# Altium schematic sheet SI5324_CDR_WR_oscillators.SchDoc: Sayma AMC
size 420 x 297 mm; $$Internal___BlkDate: 0:12:25_2-9-18; $$Internal_NAME_PLACEHOLDER: a3sheet; $$Internal_Resolution: 00001mm; $$NotCommonProperty_@NAME: SI5324_CLK_RECOVERY; $$NotCommonProperty_@PRINTORDER: 30; $$NotCommonProperty_@SHEET: 1; $$NotCommonProperty_@SHEETTOTAL: 30; CmpIndex: 26; Drawing Author: G.Kasprowicz; Drawing Number: Sayma AMC; Drawing Project: AMC FMC Carrier Board; Drawing Revision: 2.0; SymIndex: 2141; CheckedBy: P.Kulik,T.Przywozki,W.Ruclo; Author: G.Kasprowicz; CompanyName: WUT ISE; DrawnBy: G.Kasprowicz; Organization: WUT ISE; Address1: PW ISE; Address2: Nowowiejska 15/19 00-665 Warsaw; Address3: gkasprow@gmail.com; DocumentNumber: 17; Revision: 2; SheetNumber: 17; SheetTotal: 32; ModifiedBy: -; CheckedDate: -; Title2: Si5324 CDR & WR clocks; DivGrp: WUT ISE; Designer: G.Kasprowicz; ModifiedDate: -; ProjectName: Sensor Box
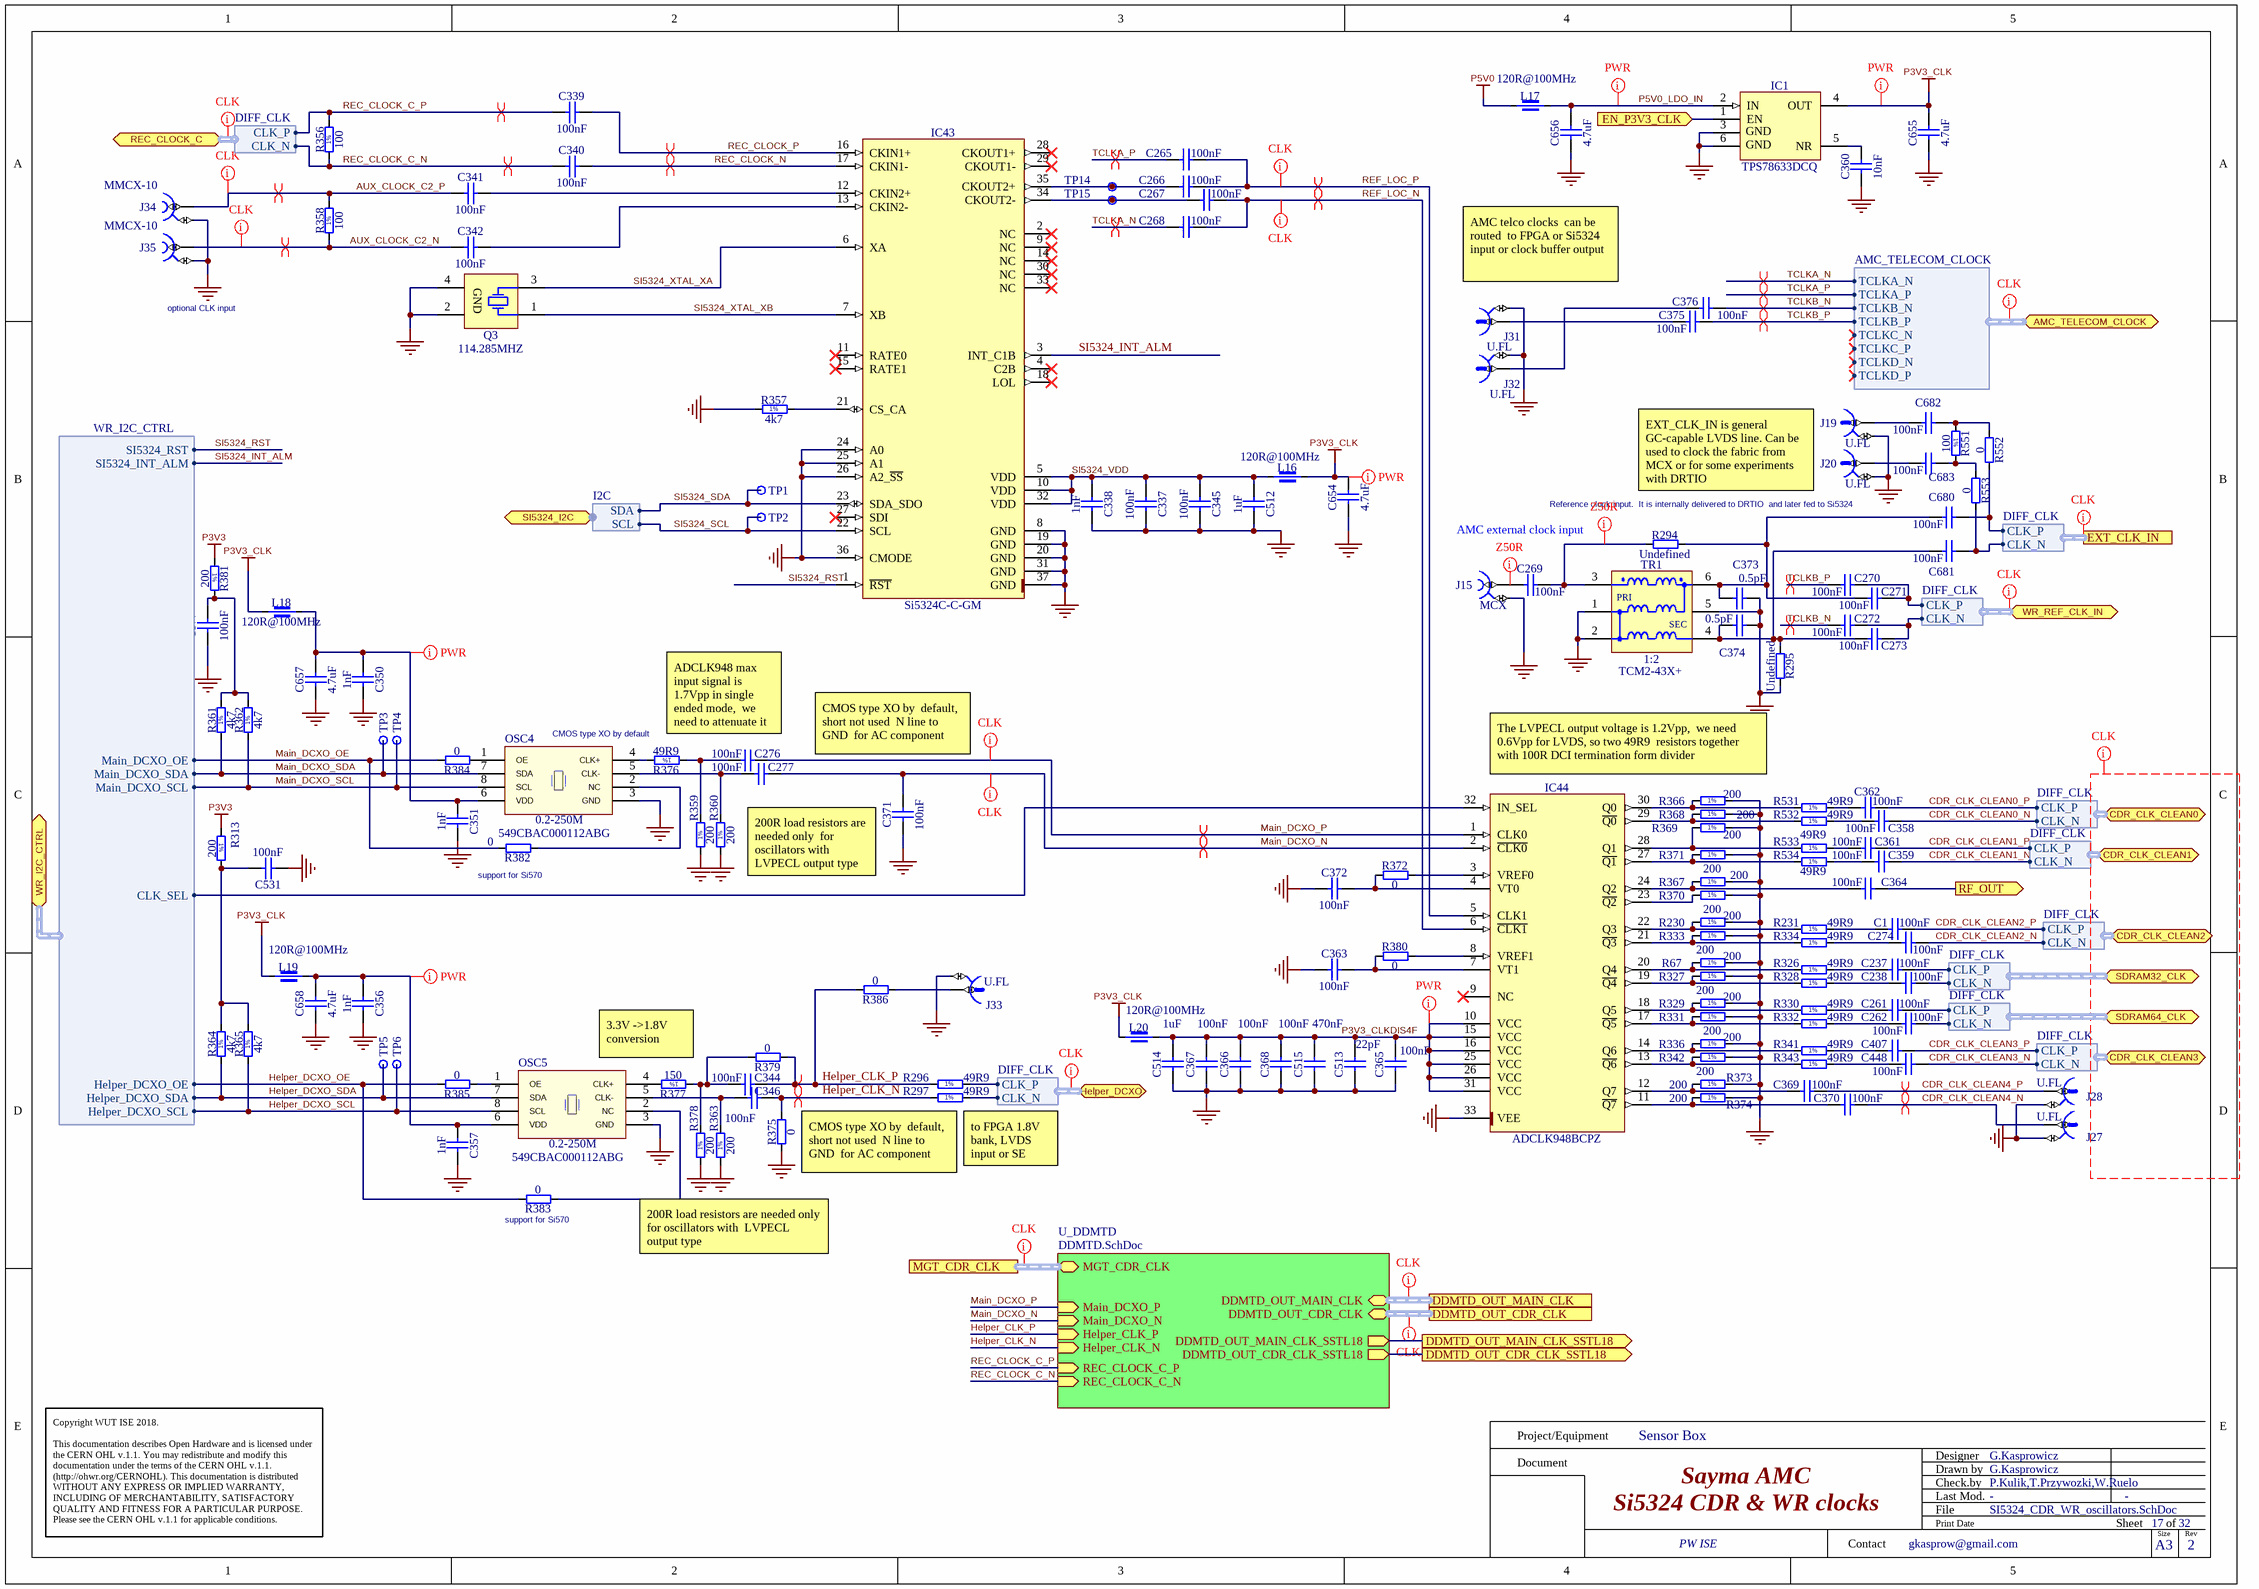
[diagram p0: SI5324_CDR_WR_oscillators.SchDoc]

## Parts
C1  100nF  [CAPC0603X33N]
C237  100nF  [CAPC0603X33N]
C238  100nF  [CAPC0603X33N]
C261  100nF  [CAPC0603X33N]
C262  100nF  [CAPC0603X33N]
C265  100nF  [CAPC1005X55N]
C266  100nF  [CAPC1005X55N]
C267  100nF  [CAPC1005X55N]
C268  100nF  [CAPC1005X55N]
C269  100nF  [CAPC1005X55N]
C270  100nF  [CAPC1005X55N]
C271  100nF  [CAPC1005X55N]
C272  100nF  [CAPC1005X55N]
C273  100nF  [CAPC1005X55N]
C274  100nF  [CAPC0603X33N]
C276  100nF  [CAPC1005X55N]
C277  100nF  [CAPC1005X55N]
C337  100nF  [CAPC0603X33N]
C338  1nF  [CAPC0603X33N]
C339  100nF  [CAPC0603X33N]
C340  100nF  [CAPC0603X33N]
C341  100nF  [CAPC0603X33N]
C342  100nF  [CAPC0603X33N]
C344  100nF  [CAPC1005X55N]
C345  100nF  [CAPC0603X33N]
C346  100nF  [CAPC1005X55N]
C350  1nF  [CAPC0603X33N]
C351  1nF  [CAPC0603X33N]
C356  1nF  [CAPC0603X33N]
C357  1nF  [CAPC0603X33N]
C358  100nF  [CAPC0603X33N]
C359  100nF  [CAPC0603X33N]
C360  10nF  [CAPC1608X87N]
C361  100nF  [CAPC0603X33N]
C362  100nF  [CAPC0603X33N]
C363  100nF  [CAPC0603X33N]
C364  100nF  [CAPC0603X33N]
C365  100nF  [CAPC0603X33N]
C366  100nF  [CAPC0603X33N]
C367  100nF  [CAPC0603X33N]
C368  100nF  [CAPC0603X33N]
C369  100nF  [CAPC0603X33N]
C370  100nF  [CAPC0603X33N]
C371  100nF  [CAPC0603X33N]
C372  100nF  [CAPC0603X33N]
C373  0.5pF  [CAPC1005X50N]
C374  0.5pF  [CAPC1005X50N]
C375  100nF  [CAPC0603X33N]
C376  100nF  [CAPC0603X33N]
C377  100nF  [CAPC0603X33N]
C407  100nF  [CAPC0603X33N]
C448  100nF  [CAPC0603X33N]
C512  1uF  [CAPC1005X55N]
C513  22pF  [CAPC1005X55N]
C514  1uF  [CAPC1005X55N]
C515  470nF  [CAPC1005X55N]
C531  100nF  [CAPC0603X33N]
C654  4.7uF  [CAPC1608X90N]
C655  4.7uF  [CAPC1608X90N]
C656  4.7uF  [CAPC1608X90N]
C657  4.7uF  [CAPC1608X90N]
C658  4.7uF  [CAPC1608X90N]
C680  100nF  [CAPC1005X55N]
C681  100nF  [CAPC1005X55N]
C682  100nF  [CAPC1005X55N]
C683  100nF  [CAPC1005X55N]
IC1  TPS78633DCQ  [SOT127P700X180-6N]
IC43  Si5324C-C-GM  [QFN50P600X600X90-37N-S425]
IC44  ADCLK948BCPZ  [QFN50P500X500X80-33N-S285]
J15  MCX  [AMPHENOL_ARF2521-ND]
J19  U.FL  [HIROSE_U.FL-R-SMT-1(10)]
J20  U.FL  [HIROSE_U.FL-R-SMT-1(10)]
J27  U.FL  [HIROSE_U.FL-R-SMT-1(10)]
J28  U.FL  [HIROSE_U.FL-R-SMT-1(10)]
J31  U.FL  [HIROSE_U.FL-R-SMT-1(10)]
J32  U.FL  [HIROSE_U.FL-R-SMT-1(10)]
J33  U.FL  [HIROSE_U.FL-R-SMT-1(10)]
J34  Part Number: MMCX-10  [NINIGI_MMCX-10]  (hidden comment: Coax_1Female_1Shield)
J35  Part Number: MMCX-10  [NINIGI_MMCX-10]  (hidden comment: Coax_1Female_1Shield)
L16  120R@100MHz  [INDC1608X95N]
L17  120R@100MHz  [INDC1608X95N]
L18  120R@100MHz  [INDC1608X95N]
L19  120R@100MHz  [INDC1608X95N]
L20  120R@100MHz  [INDC1608X95N]
OSC4  0.2-250M  Manufacturer Part Number: 549CBAC000112ABG  [OSC_SILICON-LAB_SI549]
OSC5  0.2-250M  Manufacturer Part Number: 549CBAC000112ABG  [OSC_SILICON-LAB_SI549]
Q3  114.285MHZ  [XTAL_CONNOR_CS]
R67  200  [RESC1005X40N]
R230  200  [RESC1005X40N]
R231  49R9  [RESC1005X40N]
R294  Undefined  [RESC1005X40N]
R295  Undefined  [RESC1005X40N]
R296  49R9  [RESC1005X40N]
R297  49R9  [RESC1005X40N]
R313  200  [RESC1005X40N]
R326  49R9  [RESC1005X40N]
R327  200  [RESC1005X40N]
R328  49R9  [RESC1005X40N]
R329  200  [RESC1005X40N]
R330  49R9  [RESC1005X40N]
R331  200  [RESC1005X40N]
R332  49R9  [RESC1005X40N]
R333  200  [RESC1005X40N]
R334  49R9  [RESC1005X40N]
R336  200  [RESC1005X40N]
R341  49R9  [RESC1005X40N]
R342  200  [RESC1005X40N]
R343  49R9  [RESC1005X40N]
R356  100  [RESC1005X40N]
R357  4k7  [RESC1005X40N]
R358  100  [RESC1005X40N]
R359  200  [RESC1005X40N]
R360  200  [RESC1005X40N]
R361  4k7  [RESC1005X40N]
R362  4k7  [RESC1005X40N]
R363  200  [RESC1005X40N]
R364  4k7  [RESC1005X40N]
R365  4k7  [RESC1005X40N]
R366  200  [RESC1005X40N]
R367  200  [RESC1005X40N]
R368  200  [RESC1005X40N]
R369  200  [RESC1005X40N]
R370  200  [RESC1005X40N]
R371  200  [RESC1005X40N]
R372  0  [RESC1005X40N]
R373  200  [RESC1005X40N]
R374  200  [RESC1005X40N]
R375  0  [RESC1005X40N]
R376  49R9  [RESC1005X40N]
R377  150  [RESC1005X40N]
R378  200  [RESC1005X40N]
R379  0  [RESC1005X40N]
R380  0  [RESC1005X40N]
R381  200  [RESC1005X40N]
R382  0  [RESC1005X40N]
R383  0  [RESC1005X40N]
R384  0  [RESC1005X40N]
R385  0  [RESC1005X40N]
R386  0  [RESC1005X40N]
R531  49R9  [RESC1005X40N]
R532  49R9  [RESC1005X40N]
R533  49R9  [RESC1005X40N]
R534  49R9  [RESC1005X40N]
R551  100  [RESC1005X40N]
R552  0  [RESC1005X40N]
R553  0  [RESC1005X40N]
TP1  Test Point  [TPS127]  (value not drawn)
TP2  Test Point  [TPS127]  (value not drawn)
TP3  Test Point  [TPS127]  (value not drawn)
TP4  Test Point  [TPS127]  (value not drawn)
TP5  Test Point  [TPS127]  (value not drawn)
TP6  Test Point  [TPS127]  (value not drawn)
TP14  Test Point  [TPS127]  (value not drawn)
TP15  Test Point  [TPS127]  (value not drawn)
TR1  1:2  Manufacturer Part Number: TCM2-43X+  [XFMR_MINI-CIRCUITS_DB1627]

## Sub-sheets
U_DDMTD = DDMTD.SchDoc: MGT_CDR_CLK (bidir, harness DIFF_CLK), DDMTD_OUT_CDR_CLK (bidir, harness DIFF_CLK), DDMTD_OUT_MAIN_CLK (bidir, harness DIFF_CLK), Main_DCXO_P (in), Main_DCXO_N (in), Helper_CLK_P (in), Helper_CLK_N (in), REC_CLOCK_C_P (in), REC_CLOCK_C_N (in), DDMTD_OUT_MAIN_CLK_SSTL18 (out), DDMTD_OUT_CDR_CLK_SSTL18 (out)

## Ports
AMC_TELECOM_CLOCK (bidir, harness AMC_TELECOM_CLOCK), CDR_CLK_CLEAN0 (bidir, harness DIFF_CLK), CDR_CLK_CLEAN1 (bidir, harness DIFF_CLK), CDR_CLK_CLEAN2 (bidir, harness DIFF_CLK), CDR_CLK_CLEAN3 (bidir, harness DIFF_CLK), DDMTD_OUT_CDR_CLK (harness DIFF_CLK), DDMTD_OUT_CDR_CLK_SSTL18 (out), DDMTD_OUT_MAIN_CLK (harness DIFF_CLK), DDMTD_OUT_MAIN_CLK_SSTL18 (out), EN_P3V3_CLK (in), EXT_CLK_IN (harness DIFF_CLK), Helper_DCXO (bidir, harness DIFF_CLK), MGT_CDR_CLK (harness DIFF_CLK), REC_CLOCK_C (bidir, harness DIFF_CLK), RF_OUT (out), SDRAM32_CLK (bidir, harness DIFF_CLK), SDRAM64_CLK (bidir, harness DIFF_CLK), SI5324_I2C (bidir, harness I2C), WR_I2C_CTRL (bidir, harness WR_I2C_CTRL), WR_REF_CLK_IN (bidir, harness DIFF_CLK)

## Harnesses
AMC_TELECOM_CLOCK: TCLKA_N, TCLKA_P, TCLKB_N, TCLKB_P, TCLKC_N, TCLKC_P, TCLKD_N, TCLKD_P
I2C: SCL, SDA
WR_I2C_CTRL: Main_DCXO_OE, Main_DCXO_SDA, Main_DCXO_SCL, Helper_DCXO_OE, Helper_DCXO_SDA, Helper_DCXO_SCL, CLK_SEL, SI5324_RST, SI5324_INT_ALM
DIFF_CLK: CLK_N, CLK_P

## Nets
GND: C337.1 C338.1 C345.1 C350.1 C351.1 C356.1 C357.1 C360.1 C363.1 C365.1 C366.1 C367.1 C368.1 C371.1 C372.1 C373.2 C374.2 C377.1 C512.2 C513.1 C514.2 C515.1 C531.1 C654.1 C655.1 C656.1 C657.1 C658.1 IC1.3(GND) IC1.6(GND) IC43.8(GND) IC43.19(GND) IC43.20(GND) IC43.24(A0) IC43.25(A1) IC43.26(A2_~{SS}) IC43.31(GND) IC43.36(CMODE) IC43.37(GND) IC44.33(VEE) J15.2 J19.2 J20.2 J27.2 J28.2 J31.2 J32.2 J33.2 J34.2 J35.2 OSC4.3(GND) OSC5.3(GND) Q3.2(GND) Q3.4(GND) R67.2 R230.2 R295.1 R327.2 R329.2 R331.2 R333.2 R336.2 R342.2 R357.1 R359.1 R360.1 R363.1 R366.2 R367.2 R368.2 R369.2 R370.2 R371.2 R373.2 R374.2 R375.1 R378.1 TR1.1(P1) TR1.2(P1) TR1.5(NC)
P3V3: R313.1 R381.1
P3V3_CLK: C654.2 C655.2 IC1.4(OUT) L16.1 L18.1 L19.1 L20.1
P5V0: L17.1
AUX_CLOCK_C2_N: C342.2 J35.1 R358.1
AUX_CLOCK_C2_P: C341.2 J34.1 R358.2
CDR_CLK_CLEAN0_N: C358.2 ; port CDR_CLK_CLEAN0.CLK_N
CDR_CLK_CLEAN0_P: C362.2 ; port CDR_CLK_CLEAN0.CLK_P
CDR_CLK_CLEAN1_N: C359.2 ; port CDR_CLK_CLEAN1.CLK_N
CDR_CLK_CLEAN1_P: C361.2 ; port CDR_CLK_CLEAN1.CLK_P
CDR_CLK_CLEAN2_N: C274.2 ; port CDR_CLK_CLEAN2.CLK_N
CDR_CLK_CLEAN2_P: C1.2 ; port CDR_CLK_CLEAN2.CLK_P
CDR_CLK_CLEAN3_N: C448.2 ; port CDR_CLK_CLEAN3.CLK_N
CDR_CLK_CLEAN3_P: C407.2 ; port CDR_CLK_CLEAN3.CLK_P
CDR_CLK_CLEAN4_N: C370.2 J27.1
CDR_CLK_CLEAN4_P: C369.2 J28.1
DDMTD_OUT_CDR_CLK_SSTL18: port DDMTD_OUT_CDR_CLK_SSTL18, sheet U_DDMTD/DDMTD_OUT_CDR_CLK_SSTL18
DDMTD_OUT_MAIN_CLK_SSTL18: port DDMTD_OUT_MAIN_CLK_SSTL18, sheet U_DDMTD/DDMTD_OUT_MAIN_CLK_SSTL18
EN_P3V3_CLK: IC1.1(EN) ; port EN_P3V3_CLK
Helper_CLK_N: C346.2 R297.1 R375.2 ; sheet U_DDMTD/Helper_CLK_N
Helper_CLK_P: C344.2 R296.1 R379.1 R386.2 ; sheet U_DDMTD/Helper_CLK_P
Helper_DCXO_OE: R383.2 R385.2 ; port WR_I2C_CTRL.Helper_DCXO_OE
Helper_DCXO_SCL: OSC5.8(SCL) R365.1 TP6.1 ; port WR_I2C_CTRL.Helper_DCXO_SCL
Helper_DCXO_SDA: OSC5.7(SDA) R364.1 TP5.1 ; port WR_I2C_CTRL.Helper_DCXO_SDA
Main_DCXO_N: C277.2 C371.2 IC44.2(~{CLK0}) ; sheet U_DDMTD/Main_DCXO_N
Main_DCXO_OE: R382.2 R384.2 ; port WR_I2C_CTRL.Main_DCXO_OE
Main_DCXO_P: C276.2 IC44.1(CLK0) ; sheet U_DDMTD/Main_DCXO_P
Main_DCXO_SCL: OSC4.8(SCL) R362.1 TP4.1 ; port WR_I2C_CTRL.Main_DCXO_SCL
Main_DCXO_SDA: OSC4.7(SDA) R361.1 TP3.1 ; port WR_I2C_CTRL.Main_DCXO_SDA
P3V3_CLKDIS4F: C365.2 C366.2 C367.2 C368.2 C513.2 C514.1 C515.2 IC44.10(VCC) IC44.15(VCC) IC44.16(VCC) IC44.25(VCC) IC44.26(VCC) IC44.31(VCC) L20.2
P5V0_LDO_IN: C656.2 IC1.2(IN) L17.2
REC_CLOCK_C_N: C340.2 R356.1 ; sheet U_DDMTD/REC_CLOCK_C_N, port REC_CLOCK_C.CLK_N
REC_CLOCK_C_P: C339.2 R356.2 ; sheet U_DDMTD/REC_CLOCK_C_P, port REC_CLOCK_C.CLK_P
REC_CLOCK_N: C340.1 IC43.17(CKIN1-)
REC_CLOCK_P: C339.1 IC43.16(CKIN1+)
REF_LOC_N: C267.2 C268.2 IC44.6(~{CLK1})
REF_LOC_P: C265.2 C266.2 IC44.5(CLK1)
RF_OUT: C364.2 ; port RF_OUT
SI5324_INT_ALM: IC43.3(INT_C1B) ; port WR_I2C_CTRL.SI5324_INT_ALM
SI5324_RST: IC43.1(~{RST}) ; port WR_I2C_CTRL.SI5324_RST
SI5324_SCL: IC43.22(SCL) TP2.1 ; port SI5324_I2C.SCL
SI5324_SDA: IC43.23(SDA_SDO) TP1.1 ; port SI5324_I2C.SDA
SI5324_VDD: C337.2 C338.2 C345.2 C512.1 IC43.5(VDD) IC43.10(VDD) IC43.32(VDD) L16.2
SI5324_XTAL_XA: IC43.6(XA) Q3.3(X)
SI5324_XTAL_XB: IC43.7(XB) Q3.1(X)
TCLKA_N: C268.1 ; port AMC_TELECOM_CLOCK.TCLKA_N
TCLKA_P: C265.1 ; port AMC_TELECOM_CLOCK.TCLKA_P
TCLKB_N: C272.1 C376.2 ; port AMC_TELECOM_CLOCK.TCLKB_N
TCLKB_P: C270.1 C375.2 ; port AMC_TELECOM_CLOCK.TCLKB_P
NetC1_1: C1.1 R231.2
NetC237_1: C237.1 R326.2
NetC237_2: C237.2 ; port SDRAM32_CLK.CLK_P
NetC238_1: C238.1 R328.2
NetC238_2: C238.2 ; port SDRAM32_CLK.CLK_N
NetC261_1: C261.1 R330.2
NetC261_2: C261.2 ; port SDRAM64_CLK.CLK_P
NetC262_1: C262.1 R332.2
NetC262_2: C262.2 ; port SDRAM64_CLK.CLK_N
NetC266_1: C266.1 IC43.35(CKOUT2+) TP14.1
NetC267_1: C267.1 IC43.34(CKOUT2-) TP15.1
NetC269_1: C269.1 J15.1
NetC269_2: C269.2 R294.2 TR1.3(P1)
NetC270_2: C270.2 C271.2 ; port WR_REF_CLK_IN.CLK_P
NetC271_1: C271.1 C373.1 C680.1 R294.1 TR1.6(S1)
NetC272_2: C272.2 C273.2 ; port WR_REF_CLK_IN.CLK_N
NetC273_1: C273.1 C374.1 C681.1 R295.2 TR1.4(S1)
NetC274_1: C274.1 R334.2
NetC276_1: C276.1 R359.2 R376.1
NetC277_1: C277.1 OSC4.5(CLK-) R360.2
NetC341_1: C341.1 IC43.12(CKIN2+)
NetC342_1: C342.1 IC43.13(CKIN2-)
NetC344_1: C344.1 R377.1 R378.2 R379.2
NetC346_1: C346.1 OSC5.5(CLK-) R363.2
NetC350_2: C350.2 C351.2 C657.2 L18.2 OSC4.6(VDD)
NetC356_2: C356.2 C357.2 C658.2 L19.2 OSC5.6(VDD)
NetC358_1: C358.1 R532.2
NetC359_1: C359.1 R534.2
NetC360_2: C360.2 IC1.5(NR)
NetC361_1: C361.1 R533.2
NetC362_1: C362.1 R531.2
NetC363_2: C363.2 IC44.7(VT1) R380.1
NetC364_1: C364.1 IC44.24(Q2) R367.1
NetC369_1: C369.1 IC44.12(Q7) R373.1
NetC370_1: C370.1 IC44.11(~{Q7}) R374.1
NetC372_2: C372.2 IC44.4(VT0) R372.1
NetC375_1: C375.1 J31.1
NetC376_1: C376.1 J32.1
NetC377_2: C377.2 R361.2 R362.2 R381.2
NetC407_1: C407.1 R341.2
NetC448_1: C448.1 R343.2
NetC531_2: C531.2 R313.2 R364.2 R365.2
NetC680_2: C680.2 R552.2 ; port EXT_CLK_IN.CLK_P
NetC681_2: C681.2 R553.2 ; port EXT_CLK_IN.CLK_N
NetC682_1: C682.1 J19.1
NetC682_2: C682.2 R551.1 R552.1
NetC683_1: C683.1 J20.1
NetC683_2: C683.2 R551.2 R553.1
NetIC43_21: IC43.21(CS_CA) R357.2
NetIC44_3: IC44.3(VREF0) R372.2
NetIC44_8: IC44.8(VREF1) R380.2
NetIC44_13: IC44.13(~{Q6}) R342.1 R343.1
NetIC44_14: IC44.14(Q6) R336.1 R341.1
NetIC44_17: IC44.17(~{Q5}) R331.1 R332.1
NetIC44_18: IC44.18(Q5) R329.1 R330.1
NetIC44_19: IC44.19(~{Q4}) R327.1 R328.1
NetIC44_20: IC44.20(Q4) R67.1 R326.1
NetIC44_21: IC44.21(~{Q3}) R333.1 R334.1
NetIC44_22: IC44.22(Q3) R230.1 R231.1
NetIC44_23: IC44.23(~{Q2}) R370.1
NetIC44_27: IC44.27(~{Q1}) R371.1 R534.1
NetIC44_28: IC44.28(Q1) R369.1 R533.1
NetIC44_29: IC44.29(~{Q0}) R368.1 R532.1
NetIC44_30: IC44.30(Q0) R366.1 R531.1
NetIC44_32: IC44.32(IN_SEL) ; port WR_I2C_CTRL.CLK_SEL
NetJ33_1: J33.1 R386.1
NetOSC4_1: OSC4.1(OE) R384.1
NetOSC4_2: OSC4.2(NC) R382.1
NetOSC4_4: OSC4.4(CLK+) R376.2
NetOSC5_1: OSC5.1(OE) R385.1
NetOSC5_2: OSC5.2(NC) R383.1
NetOSC5_4: OSC5.4(CLK+) R377.2
NetR296_2: R296.2 ; port Helper_DCXO.CLK_P
NetR297_2: R297.2 ; port Helper_DCXO.CLK_N

Not connected (* = marked no-connect by the designer): IC43 2(NC)* 4(C2B)* 9(NC)* 11(RATE0)* 14(NC)* 15(RATE1)* 18(LOL)* 27(SDI)* 28(CKOUT1+)* 29(CKOUT1-)* 30(NC)* 33(NC)*; IC44 9(NC)*

## Buses and harness runs
harness port DDMTD_OUT_CDR_CLK = sheet U_DDMTD/DDMTD_OUT_CDR_CLK
harness port DDMTD_OUT_MAIN_CLK = sheet U_DDMTD/DDMTD_OUT_MAIN_CLK
harness port MGT_CDR_CLK = sheet U_DDMTD/MGT_CDR_CLK

## Layout directives
differential pair: AUX_CLOCK_C2_N, AUX_CLOCK_C2_P, CDR_CLK_CLEAN4_N, CDR_CLK_CLEAN4_P, Helper_CLK_N, Helper_CLK_P, Main_DCXO_N, Main_DCXO_P, REC_CLOCK_C_N, REC_CLOCK_C_P, REC_CLOCK_N, REC_CLOCK_P, REF_LOC_N, REF_LOC_P, TCLKA_N, TCLKA_P, TCLKB_N, TCLKB_P
net class PWR: NetC350_2, NetC356_2, P3V3_CLK, P3V3_CLKDIS4F, P5V0_LDO_IN
net class CLK: (no net found under the mark), AUX_CLOCK_C2_N, AUX_CLOCK_C2_P, Main_DCXO_N, Main_DCXO_P, REF_LOC_N, REF_LOC_P
net class Z50R: NetC269_1, NetC269_2

## Notes on the sheet
- (near J35) optional CLK input
- (near J31) AMC telco clocks  can be routed  to FPGA or Si5324  input or clock buffer output
- AMC external clock input
- EXT_CLK_IN is general GC-capable LVDS line. Can be used to clock the fabric from MCX or for some experiments with DRTIO
- Reference clock input.  It is internally delivered to DRTIO  and later fed to Si5324
- ADCLK948 max input signal is 1.7Vpp in single  ended mode,  we need to attenuate it
- CMOS type XO by default
- CMOS type XO by  default, short not used  N line to GND  for AC component
- The LVPECL output voltage is 1.2Vpp,  we need 0.6Vpp for LVDS, so two 49R9  resistors together with 100R DCI termination form divider
- (near R382) support for Si570
- 200R load resistors are needed only  for oscillators with  LVPECL output type
- 3.3V ->1.8V  conversion
- (near R297) to FPGA 1.8V bank, LVDS input or SE mode
- (near R383) support for Si570
- Project/Equipment
- Document
- Designer
- Drawn by
- Check.by
- Copyright WUT ISE 2018.
  This documentation describes Open Hardware and is licensed under the CERN OHL v.1.1. You may redistribute and modify this documentation under the terms of the CERN OHL v.1.1. (http://ohwr.org/CERNOHL). This documentation is distributed WITHOUT ANY EXPRESS OR IMPLIED WARRANTY, INCLUDING OF MERCHANTABILITY, SATISFACTORY QUALITY AND FITNESS FOR A PARTICULAR PURPOSE. Please see the CERN OHL v.1.1 for applicable conditions.
- Contact
- File
- Last Mod.
- Print Date
- Sheet
- Size
- A3
- of
- Rev
- (in symbol R0402_4K7_1%_0.0625W_100PPM) 1%
- (in symbol R0402_49R9_1%_0.0625W_100PPM) 1%
- (in symbol R0402_100R_1%_0.0625W_100PPM) 1%
- (in symbol R0402_150R_1%_0.0625W_100PPM) 1%
- (in symbol R0402_200R_1%_0.0625W_100PPM) 1%
- (in symbol XFMR_MINI-CIRCUITS_TCM2-43X+) PRI; SEC

## Library data of the parts
C1 C237 C238 C261 C262 C274 C337 C339-C342 C345 C358 C359 C361-C372 C375-C377 C407 C448 C531 = CC0201_100NF_6.3V_10%_X5R: Non-polarised capacitor; Manufacturer: GENERIC; Part Description: SMD Multilayer Chip Ceramic Capacitor; Manufacturer1 Part Number: 02016D104KAT2A; Tolerance: ±10%; Voltage: 6.3V; TC: X5R; Manufacturer Part Number: CC0201_100NF_6.3V_10%_X5R; Part Number: CC0201_100NF_6.3V_10%_X5R; Value: 100nF; Component Kind: Standard; Component Type: Standard; Pin Count: 2; Status: Not Recommended; Case: 0201; Mounted: Yes; Socket: No; SMD: Yes; Sense: No; Manufacturer1 Example: AVX; Manufacturer1 ComponentHeight: 0.33mm; HelpURL: \\cern.ch\dfs\Applications\Altium\Datasheets\CC0201_X5R_AVX.pdf; Author: CERN DEM JLC; CreateDate: 03.12.2007; LatestRevisionDate: 03.12.2007
C265-C273 C276 C277 C344 C346 C680-C683 = CC0402_100NF_16V_10%_X5R: Non-polarised capacitor; Manufacturer: GENERIC; Manufacturer1 Part Number: GRM155R61C104KA88D; Part Description: SMD Multilayer Chip Ceramic Capacitor; TC: X5R; Tolerance: ±10%; Voltage: 16V; Case: 0402; Manufacturer Part Number: CC0402_100NF_16V_10%_X5R; Manufacturer1 Example: MURATA; Part Number: CC0402_100NF_16V_10%_X5R; Pin Count: 2; SMD: Yes; Status: None; Value: 100nF; Component Kind: Standard; Component Type: Standard; Mounted: Yes; Socket: No; Sense: No; Manufacturer1 ComponentHeight: 0.55mm; HelpURL: \\cern.ch\dfs\Applications\Altium\Datasheets\CC0402_X5R_MURATA_GRM.pdf; Author: CERN DEM JLC; CreateDate: 10.12.2013; LatestRevisionDate: 10.12.2013
C338 C350 C351 C356 C357 = CC0201_1NF_16V_10%_X5R: Non-polarised capacitor; Manufacturer: GENERIC; Part Description: SMD Multilayer Chip Ceramic Capacitor; Manufacturer1 Part Number: 0201YD102KAT2A; Tolerance: ±10%; Voltage: 16V; TC: X5R; Manufacturer Part Number: CC0201_1NF_16V_10%_X5R; Part Number: CC0201_1NF_16V_10%_X5R; Value: 1nF; Component Kind: Standard; Component Type: Standard; Pin Count: 2; Status: Not Recommended; Case: 0201; Mounted: Yes; Socket: No; SMD: Yes; Sense: No; Manufacturer1 Example: AVX; Manufacturer1 ComponentHeight: 0.33mm; HelpURL: \\cern.ch\dfs\Applications\Altium\Datasheets\CC0201_X5R_AVX.pdf; Author: CERN DEM JLC; CreateDate: 03.12.2007; LatestRevisionDate: 03.12.2007
C360 = CC0603_10NF_50V_5%_C0G: Non-polarised capacitor; Part Description: SMD Multilayer Chip Ceramic Capacitor; Manufacturer: GENERIC; Manufacturer1 Part Number: C1608C0G1H103J080AA; Voltage: 50V; TC: C0G/NP0; Tolerance: ±5%; Part Number: CC0603_10NF_50V_5%_C0G; Component Kind: Standard; Component Type: Standard; Pin Count: 2; Value: 10nF; Status: Preferred; Manufacturer Part Number: CC0603_10NF_50V_5%_C0G; Case: 0603; Mounted: Yes; Socket: No; SMD: Yes; Sense: No; Manufacturer1 Example: TDK; Manufacturer1 ComponentHeight: 0.9mm; HelpURL: \\cern.ch\dfs\Applications\Altium\Datasheets\CC0603_C0G_TDK_C.pdf; Author: CERN DEM JLC; CreateDate: 10.12.2014; LatestRevisionDate: 10.12.2014
C373 C374 = CC0402_0.5PF_25V_0.05PF_AVX_04023J0R5ABSTR: Non-polarised capacitor; Part Description: Thin-Film Chip Capacitors for RF Signal and Power Applications, Accu-P Series; Manufacturer: AVX; Voltage: 25V; Tolerance: ±0.05pF; Part Number: CC0402_0.5PF_25V_0.05PF_AVX_04023J0R5ABSTR; Component Kind: Standard; Component Type: Standard; Pin Count: 2; Value: 0.5pF; Status: None; Manufacturer Part Number: 04023J0R5ABSTR; Case: 0402; Mounted: Yes; Socket: No; SMD: Yes; Sense: No; ComponentHeight: 0.5mm; HelpURL: \\cern.ch\dfs\Applications\Altium\Datasheets\CC0402_AVX_ACCU-P.pdf; Author: CERN DEM JLC; CreateDate: 22.02.2017; LatestRevisionDate: 22.02.2017
C512 C514 = CC0402_1UF_16V_10%_X5R: Non-polarised capacitor; Manufacturer: GENERIC; Part Description: SMD Multilayer Chip Ceramic Capacitor; Manufacturer1 Part Number: C1005X5R1C105KT; Tolerance: ±10%; Voltage: 16V; TC: X5R; Manufacturer Part Number: CC0402_1UF_16V_10%_X5R; Part Number: CC0402_1UF_16V_10%_X5R; Value: 1uF; Component Kind: Standard; Component Type: Standard; Pin Count: 2; Status: Preferred; Case: 0402; Mounted: Yes; Socket: No; SMD: Yes; Sense: No; Manufacturer1 Example: TDK; Manufacturer1 ComponentHeight: 0.55mm; HelpURL: \\cern.ch\dfs\Applications\Altium\Datasheets\CC0402_X5R_TDK_C.pdf; Author: CERN DEM JLC; CreateDate: 25.10.2012; LatestRevisionDate: 25.10.2012
C513 = CC0402_22PF_50V_5%_C0G: Non-polarised capacitor; Manufacturer: GENERIC; Part Description: SMD Multilayer Chip Ceramic Capacitor; Manufacturer1 Part Number: C0402C220J5GACTU; Tolerance: ±5%; Voltage: 50V; TC: C0G/NP0; Manufacturer Part Number: CC0402_22PF_50V_5%_C0G; Part Number: CC0402_22PF_50V_5%_C0G; Value: 22pF; Component Kind: Standard; Component Type: Standard; Pin Count: 2; Status: Preferred; Case: 0402; Mounted: Yes; Socket: No; SMD: Yes; Sense: No; Manufacturer1 Example: KEMET; Manufacturer1 ComponentHeight: 0.55mm; HelpURL: \\cern.ch\dfs\Applications\Altium\Datasheets\CC0805_C0G_KEMET_(Commercial Grade).pdf; Author: CERN DEM JLC; CreateDate: 03.12.2007; LatestRevisionDate: 03.12.2007
C515 = CC0402_470NF_16V_10%_X5R: Non-polarised capacitor; Manufacturer: GENERIC; Part Description: SMD Multilayer Chip Ceramic Capacitor; Manufacturer1 Part Number: C1005X5R1C105KT; Tolerance: ±10%; Voltage: 16V; TC: X5R; Manufacturer Part Number: CC0402_470NF_16V_10%_X5R; Part Number: CC0402_470NF_16V_10%_X5R; Value: 470nF; Component Kind: Standard; Component Type: Standard; Pin Count: 2; Status: Preferred; Case: 0402; Mounted: Yes; Socket: No; SMD: Yes; Sense: No; Manufacturer1 Example: TDK; Manufacturer1 ComponentHeight: 0.55mm; HelpURL: \\cern.ch\dfs\Applications\Altium\Datasheets\CC0402_X5R_TDK_C.pdf; Author: CERN DEM JLC; CreateDate: 25.10.2012; LatestRevisionDate: 25.10.2012
C654-C658 = CC0603_4.7UF_25V_10%_X5R: Non-polarised capacitor; Manufacturer: GENERIC; Part Description: SMD Multilayer Chip Ceramic Capacitor; Manufacturer1 Part Number: GRM188R61E475KE11D; Tolerance: ±10%; Voltage: 25V; TC: X5R; Manufacturer Part Number: CC0603_4.7UF_25V_10%_X5R; Part Number: CC0603_4.7UF_25V_10%_X5R; Value: 4.7uF; Component Kind: Standard; Component Type: Standard; Pin Count: 2; Status: None; Case: 0603; Mounted: Yes; Socket: No; SMD: Yes; Sense: No; Manufacturer1 Example: MURATA; Manufacturer1 ComponentHeight: 0.95mm; HelpURL: \\cern.ch\dfs\Applications\Altium\Datasheets\CC0603_MURATA_GRM188R61E475KE11D.pdf; Author: CERN DEM JLC; CreateDate: 10.11.2014; LatestRevisionDate: 10.11.2014
IC1 = TPS78633DCQ: Ultralow-Noise, High-PSRR, Fast, RF, 1.5A Low-Dropout Linear Regulator; Part Description: 3.3V Ultralow-Noise, High-PSRR, Fast, RF, 1.5A Low-Dropout Linear Regulator; Manufacturer: TEXAS INSTRUMENTS; PressFit: No; Bonding: No; Part Number: TPS78633DCQ; Component Kind: Standard; Component Type: Standard; Device: TPS78633DCQ; PackageDescription: SOT223, 6-Leads, Body 6.6x7.3mm (max), Pitch 1.27mm, IPC Medium Density; Manufacturer Part Number: TPS78633DCQ; Pin Count: 6; Case: SOT223; Mounted: Yes; Socket: No; SMD: Yes; Sense: No; ComponentHeight: 1.8mm; HelpURL: \\cern.ch\dfs\Applications\Altium\Datasheets\TPS78633DCQ.pdf; Author: CERN DEM JMW; CreateDate: 07.10.2008; LatestRevisionDate: 13.02.2017
IC43 = Si5324C-C-GM: Any Frequency Precision Clock Multiplier/Jitter Attenuator; Manufacturer: SILICON LABS; PressFit: No; Bonding: No; Manufacturer Part Number: Si5324C-C-GM; PackageDescription: QFN, 0.50mm Pitch, Square; 36 Pin, 6.00mm L X 6.00mm W X 0.90mm H Body (w/thermal tab 4.25mm x 4.25mm), IPC Medium Density; Part Description: Any Frequency Precision Clock Multiplier/Jitter Attenuator; Part Number: Si5324C-C-GM; Component Kind: Standard; Component Type: Standard; Device: Si5324C-C-GM; Pin Count: 37; Case: QFN36; Mounted: Yes; Socket: No; SMD: Yes; Sense: No; ComponentHeight: 0.9mm; HelpURL: \\cern.ch\dfs\Applications\Altium\Datasheets\Si5324C-C-GM.pdf; Author: CERN DEM JLC; CreateDate: 19.08.2013; LatestRevisionDate: 19.08.2013
IC44 = ADCLK948BCPZ: Two Selectable Inputs, 8 LVPECL Outputs, SiGe Clock Fanout Buffer; Manufacturer: ANALOG DEVICES; PressFit: No; Bonding: No; Manufacturer Part Number: ADCLK948BCPZ; Part Description: Two Selectable Inputs, 8 LVPECL Outputs, SiGe Clock Fanout Buffer; Part Number: ADCLK948BCPZ; Component Kind: Standard; Component Type: Standard; Device: ADCLK948BCPZ; PackageDescription: QFN, 0.50mm Pitch, Square; 8 Pin X 8 Pin, 5mm X 5mm X 1.00mm H body (w/thermal tab 2.85 X 2.85mm),  IPC Medium Density; Pin Count: 33; Case: QFN32; Mounted: Yes; Socket: No; SMD: Yes; Sense: No; ComponentHeight: 0.8mm; Author: CERN DEM MR; HelpURL: \\cern.ch\dfs\Applications\Altium\Datasheets\ADCLK948BCPZ.pdf; CreateDate: 30.11.2016; LatestRevisionDate: 30.11.2016
J15 = CON_MCX: Part Description: 50 Ohms MCX Right Angle PCB Receptacle (Jack); Manufacturer: AMPHENOL; PressFit: No; Part Number: AMPHENOL_ARF2521-ND; Component Kind: Standard; Component Type: Standard; Pin Count: 2; Family: MCX; Mounted: Yes; Socket: No; SMD: No; Sense: No; Status: None; Manufacturer Part Number: AMPHENOL_ARF2521-ND; ComponentHeight: 6; HelpURL: \\cern.ch\dfs\Applications\Altium\Datasheets\AMPHENOL_34-1030-12G.pdf; Author: GK; CreateDate: 21.02.2017; LatestRevisionDate: 21.02.2017
J19 J20 = HIROSE_U.FL-R-SMT-1(10): Part Description: Up to 6GHz Ultra Small Surface Mount Male Coaxial Connectors U.FL Series; Manufacturer: HIROSE (HRS); PressFit: No; Part Number: HIROSE_U.FL-R-SMT-1(10); Component Kind: Standard; Component Type: Standard; Pin Count: 2; Family: U.FL; Mounted: Yes; Socket: No; SMD: Yes; Sense: No; Status: None; Manufacturer Part Number: U.FL-R-SMT-1(10); ComponentHeight: 1.25mm; HelpURL: \\cern.ch\dfs\Applications\Altium\Datasheets\HIROSE_U.FL-R-SMT-1(10).pdf; Author: CERN DEM JLC; CreateDate: 24.03.2010; LatestRevisionDate: 24.03.2010
J27 J28 J31-J33 = HIROSE_U.FL-R-SMT-1(10): Manufacturer: HIROSE (HRS); Part Description: Up to 6GHz Ultra Small Surface Mount Male Coaxial Connectors U.FL Series; PressFit: No; Manufacturer Part Number: U.FL-R-SMT-1(10); Part Number: HIROSE_U.FL-R-SMT-1(10); Component Kind: Standard; Component Type: Standard; Pin Count: 2; Family: U.FL; Mounted: Yes; Socket: No; SMD: Yes; Sense: No; Status: None; ComponentHeight: 1.25mm; HelpURL: \\cern.ch\dfs\Applications\Altium\Datasheets\HIROSE_U.FL-R-SMT-1(10).pdf; Author: CERN DEM JLC; CreateDate: 24.03.2010; LatestRevisionDate: 24.03.2010
J34 J35 = CON_RF_MMCX: Part Description: Straight Through-hole 50 Ohm Micro Mini RF Jack, MMCX Series; Manufacturer: NINIGI; Manufacturer Part Number: NINIGI MMCX-10; PressFit: No; Component Kind: Standard; Component Type: Standard; Pin Count: 2; Mounted: Yes; Socket: No; Sense: No; SMD: No; Status: None; ComponentHeight: 4.35mm; HelpURL: \\cern.ch\dfs\Applications\Altium\Datasheets\SAMTEC_MMCX-J-P-H-ST-TH1.pdf; Author: GK; CreateDate: 05.12.2012; LatestRevisionDate: 05.12.2012
L16-L20 = IND0603_MURATA_BLM18PG121SN1D: Manufacturer: MURATA; Part Description: SMD EMIFIL Chip Ferrite Bead; Power: 2A; Resistance: 0.05R; Manufacturer Part Number: BLM18PG121SN1D; Part Number: IND0603_MURATA_BLM18PG121SN1D; Value: 120R@100MHz; Component Kind: Standard; Component Type: Standard; Pin Count: 2; Status: None; Case: 0603; Mounted: Yes; Socket: No; SMD: Yes; Sense: No; ComponentHeight: 0.95mm; HelpURL: \\cern.ch\dfs\Applications\Altium\Datasheets\IND0603_MURATA_BLM18P.pdf; Author: CERN DEM BC; CreateDate: 27.07.2015; LatestRevisionDate: 25.10.2018
OSC4 OSC5 = OSC_SILICON-LAB_SI549: Manufacturer: Silabs; Part Description: Ultra Low Jitter I2C Programmable XO (95 fs), 0.2 to 250MHz; Part Name: OSC_10-280MHZ_SILICON-LAB_Si570BBC000121DG; Part Number: OSC_0.2_250M_SILICON-LAB_549CBAC000112ABG; Value: 0.2-250M
Q3 = XTAL_114.285MHZ_CONNOR_CS-023: Crystal 4 pins 1=XTAL Control 2=GND3=XTAL 4=GND; Manufacturer Part Number: CS-023-114.285M; Manufacturer: CONNOR-WINFIELD; Part Description: ±20ppm 18pF -40°C to +85°C  4 Pins, 3.2x2.5X0.8mm, SMD Crystal Unit, CS-018 Series; PressFit: No; Bonding: No; PackageDescription: 4 Pins, 2.5x3.2mm, SMD Sealing Crystal, CS Series; Part Number: XTAL_114.285MHZ_CONNOR_CS-023; Value: 114.285MHZ; Component Kind: Standard; Component Type: Standard; Pin Count: 4; Mounted: Yes; Socket: No; SMD: Yes; Sense: No; ComponentHeight: 0.8mm; HelpURL: \\cern.ch\dfs\Applications\Altium\Datasheets\XTAL_CONNOR_CS-023.pdf; Author: CERN DEM JLC; CreateDate: 08.07.2014; LatestRevisionDate: 08.07.2014
R67 R230 R313 R327 R329 R331 R333 R336 R342 R359 R360 R363 R366-R371 R373 R374 R378 R381 = R0402_200R_1%_0.0625W_100PPM: Resistor - 1%; Manufacturer: GENERIC; Part Description: General Purpose Thick Film Chip Resistor; Manufacturer1 Part Number: 232270672001L; TC: ±100ppm/°C; PressFit: No; Manufacturer Part Number: R0402_200R_1%_0.0625W_100PPM; Part Number: R0402_200R_1%_0.0625W_100PPM; Tolerance: ±1%; Value: 200; Component Kind: Standard; Component Type: Standard; Pin Count: 2; Status: Not Recommended; Power: 0.0625W; Case: 0402; Mounted: Yes; Sense: No; Socket: No; SMD: Yes; Manufacturer1 Example: YAGEO PHYCOMP; Manufacturer1 ComponentHeight: 0.4mm; HelpURL: \\cern.ch\dfs\Applications\Altium\Datasheets\R0402_Phycomp_RC0402.pdf; Author: CERN DEM JLC; CreateDate: 03.12.2007; LatestRevisionDate: 17.10.2012
R231 R296 R297 R326 R328 R330 R332 R334 R341 R343 R376 R531-R534 = R0402_49R9_1%_0.0625W_100PPM: Resistor - 1%; Manufacturer: GENERIC; Part Description: General Purpose Thick Film Chip Resistor; Manufacturer1 Part Number: 232270674999L or RC0402FR-0749R9L; TC: ±100ppm/°C; PressFit: No; Manufacturer Part Number: R0402_49R9_1%_0.0625W_100PPM; Part Number: R0402_49R9_1%_0.0625W_100PPM; Tolerance: ±1%; Value: 49R9; Component Kind: Standard; Component Type: Standard; Pin Count: 2; Status: Not Recommended; Power: 0.0625W; Case: 0402; Mounted: Yes; Sense: No; Socket: No; SMD: Yes; Manufacturer1 Example: YAGEO PHYCOMP; Manufacturer1 ComponentHeight: 0.4mm; HelpURL: \\cern.ch\dfs\Applications\Altium\Datasheets\R0402_Phycomp_RC0402.pdf; Author: CERN DEM JLC; CreateDate: 24.10.2012; LatestRevisionDate: 24.10.2012
R294 R295 = R0402_NO-VALUE: Resistor; Part Description: Reserved Footprint For a 0402 (1005) Chip Resistor; PressFit: No; Mounted: No; Manufacturer Part Number: R0402_NO-VALUE; Manufacturer: Undefined; Part Number: R0402_NO-VALUE; Value: Undefined; Component Kind: Standard; Component Type: Standard; Pin Count: 2; Status: None; Case: 0402; Sense: No; Socket: No; SMD: Yes; Manufacturer1 Example: Undefined; Manufacturer1 Part Number: Undefined; Manufacturer1 ComponentHeight: Undefined; HelpURL: Undefined; Author: CERN DEM JLC; CreateDate: 03.12.2007; LatestRevisionDate: 13.03.2008
R356 R358 R551 = R0402_100R_1%_0.0625W_100PPM: Resistor - 1%; Manufacturer: GENERIC; Part Description: General Purpose Thick Film Chip Resistor; Manufacturer1 Part Number: 232270671001L; TC: ±100ppm/°C; PressFit: No; Manufacturer Part Number: R0402_100R_1%_0.0625W_100PPM; Part Number: R0402_100R_1%_0.0625W_100PPM; Tolerance: ±1%; Value: 100; Component Kind: Standard; Component Type: Standard; Pin Count: 2; Status: Not Recommended; Power: 0.0625W; Case: 0402; Mounted: Yes; Sense: No; Socket: No; SMD: Yes; Manufacturer1 Example: YAGEO PHYCOMP; Manufacturer1 ComponentHeight: 0.4mm; HelpURL: \\cern.ch\dfs\Applications\Altium\Datasheets\R0402_Phycomp_RC0402.pdf; Author: CERN DEM JLC; CreateDate: 03.12.2007; LatestRevisionDate: 17.10.2012
R357 R361 R362 R364 R365 = R0402_4K7_1%_0.0625W_100PPM: Resistor - 1%; Manufacturer: GENERIC; Part Description: General Purpose Thick Film Chip Resistor; Manufacturer1 Part Number: 232270674702L; TC: ±100ppm/°C; PressFit: No; Manufacturer Part Number: R0402_4K7_1%_0.0625W_100PPM; Part Number: R0402_4K7_1%_0.0625W_100PPM; Tolerance: ±1%; Value: 4k7; Component Kind: Standard; Component Type: Standard; Pin Count: 2; Status: Not Recommended; Power: 0.0625W; Case: 0402; Mounted: Yes; Sense: No; Socket: No; SMD: Yes; Manufacturer1 Example: YAGEO PHYCOMP; Manufacturer1 ComponentHeight: 0.4mm; HelpURL: \\cern.ch\dfs\Applications\Altium\Datasheets\R0402_Phycomp_RC0402.pdf; Author: CERN DEM JLC; CreateDate: 03.12.2007; LatestRevisionDate: 17.10.2012
R372 R375 R379 R380 R382-R386 R552 R553 = R0402_0R_JUMPER: Resistor; Manufacturer: GENERIC; Part Description: 1A (0.05R Max DC Resistance) Zero Ohm Jumper; Manufacturer1 Part Number: 232270591001L; PressFit: No; Manufacturer Part Number: R0402_0R_JUMPER; Part Number: R0402_0R_JUMPER; Value: 0; Component Kind: Standard; Component Type: Standard; Pin Count: 2; Status: Not Recommended; Case: 0402; Mounted: Yes; Sense: No; Socket: No; SMD: Yes; Manufacturer1 Example: YAGEO PHYCOMP; Manufacturer1 ComponentHeight: 0.4mm; HelpURL: \\cern.ch\dfs\Applications\Altium\Datasheets\R0402_Phycomp_RC0402.pdf; Author: CERN DEM JLC; CreateDate: 03.12.2007; LatestRevisionDate: 17.10.2012
R377 = R0402_150R_1%_0.0625W_100PPM: Resistor - 1%; Manufacturer: GENERIC; Part Description: General Purpose Thick Film Chip Resistor; Manufacturer1 Part Number: 232270671501L; TC: ±100ppm/°C; PressFit: No; Manufacturer Part Number: R0402_150R_1%_0.0625W_100PPM; Part Number: R0402_150R_1%_0.0625W_100PPM; Tolerance: ±1%; Value: 150; Component Kind: Standard; Component Type: Standard; Pin Count: 2; Status: Not Recommended; Power: 0.0625W; Case: 0402; Mounted: Yes; Sense: No; Socket: No; SMD: Yes; Manufacturer1 Example: YAGEO PHYCOMP; Manufacturer1 ComponentHeight: 0.4mm; HelpURL: \\cern.ch\dfs\Applications\Altium\Datasheets\R0402_Phycomp_RC0402.pdf; Author: CERN DEM JLC; CreateDate: 03.12.2007; LatestRevisionDate: 17.10.2012
TP1-TP6 TP14 TP15 = SMD_PAD_1.27X1.27MM: Part Description: 1.27mm x 1.27mm PCB Copper Area (SMD Test Point); Mounted: No; Part Number: SMD_PAD_1.27X1.27MM; Component Kind: Standard (No BOM); Component Type: Standard (No BOM); Pin Count: 1; Family: Test Point; Socket: No; SMD: Yes; Sense: No; Status: None; ComponentHeight: 0mm; HelpURL: Undefined; Author: CERN DEM JLC; CreateDate: 12.01.2008; LatestRevisionDate: 12.01.2008; PackageDescription: 1.27mm x 1.27mm PCB Copper Area (SMD Test Point)
TR1 = XFMR_MINI-CIRCUITS_TCM2-43X+: 50 OHMS 10 to 4000 MHz RF Transformer; Power: 0.4W; Part Number: XFMR_MINI-CIRCUITS_TCM2-43X+; Component Kind: Standard; Component Type: Standard; Pin Count: 6; Value: 1:2; Status: None; Part Description: 50 Ohms 10 to 4000MHz RF Transformer; Manufacturer: MINI-CIRCUITS; Mounted: Yes; Socket: No; Sense: No; SMD: Yes; ComponentHeight: 4.06mm; HelpURL: \\cern.ch\dfs\Applications\Altium\Datasheets\XFMR_MINI-CIRCUITS_TCM2-43X+.pdf; Author: CERN DEM BC; CreateDate: 12.02.2016; LatestRevisionDate: 12.02.2016